# EAGLE design carlos_lm3886 (EAGLE 7.6.0)
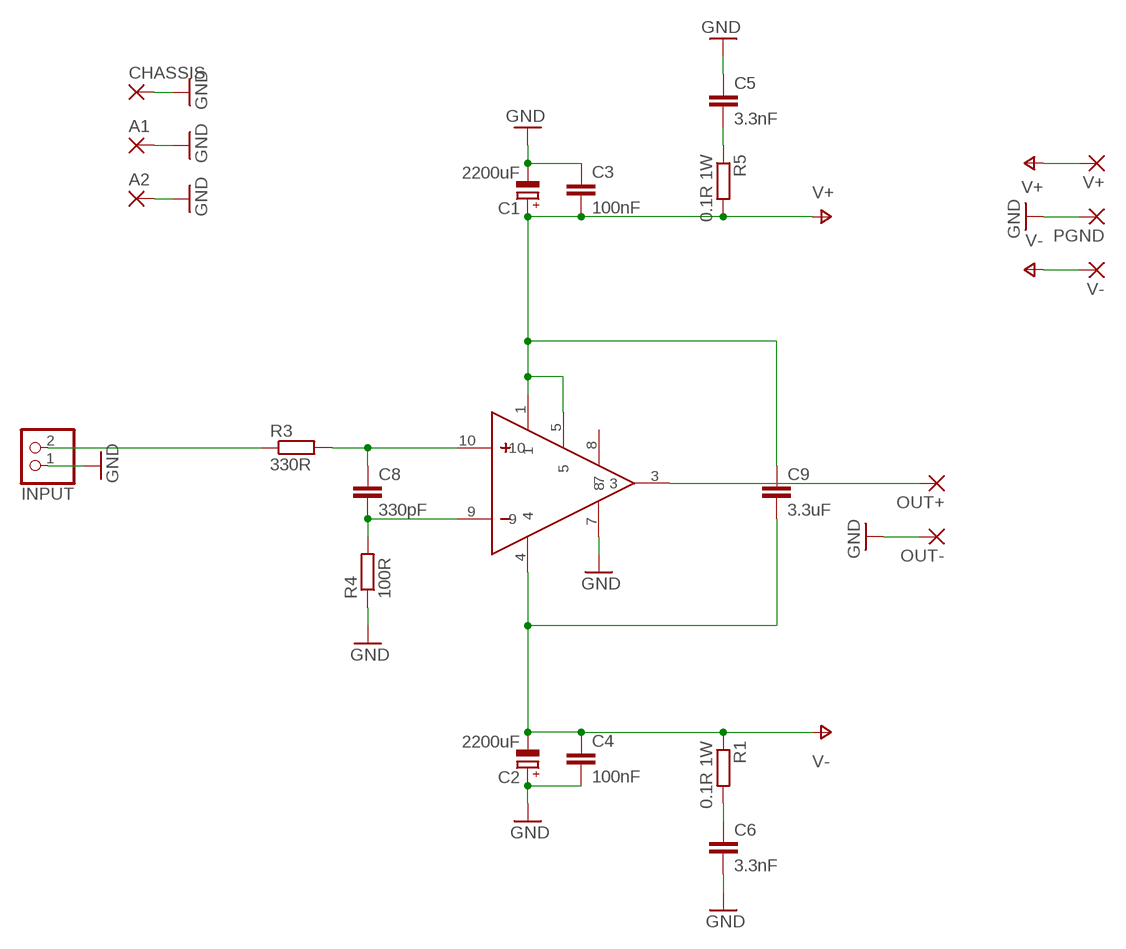
[diagram p0: schematic, sheet 1]

## Parts
A1  2,54/1,0  [2,54/1,0]
A2  2,54/1,0  [2,54/1,0]
C1  2200uF  CPOL-EUE7.5-18  [E7,5-18]
C2  2200uF  CPOL-EUE7.5-18  [E7,5-18]
C3  100nF  C-EU150-054X183  [C150-054X183]
C4  100nF  C-EU150-054X183  [C150-054X183]
C5  3.3nF  C-EU075-032X103  [C075-032X103]
C6  3.3nF  C-EU075-032X103  [C075-032X103]
C8  330pF  C-EU050-045X075  [C050-045X075]
C9  3.3uF  C-EU225-087X268  [C225-087X268]
CHASSIS  2,54/1,0  [2,54/1,0]
INPUT  PINHD-1X2  [1X02]
OUT+  2,54/1,0  [2,54/1,0]
OUT-  2,54/1,0  [2,54/1,0]
PGND  2,54/1,0  [2,54/1,0]
R1  0.1R 1W  R-EU_0309/10  [0309/10]
R3  330R  R-EU_0207/10  [0207/10]
R4  100R  R-EU_0207/10  [0207/10]
R5  0.1R 1W  R-EU_0309/10  [0309/10]
U$1  LM3886T  [TO220-11]
V+  2,54/1,0  [2,54/1,0]
V-  2,54/1,0  [2,54/1,0]

## Nets
GND: A1.1(P) A2.1(P) C1.- C2.+ C3.1 C4.2 C5.1 C6.2 CHASSIS.1(P) INPUT.1 OUT-.1(P) PGND.1(P) R4.1 U$1.7
N$1: INPUT.2 R3.1
N$3: C6.1 R1.2
N$4: C5.2 R5.1
N$5: C8.1 R3.2 U$1.10
N$6: C8.2 R4.2 U$1.9
N$7: OUT+.1(P) U$1.3
V+: C1.+ C3.2 C9.1 R5.2 U$1.1 U$1.5 V+.1(P)
V-: C2.- C4.1 C9.2 R1.1 U$1.4 V-.1(P)
Unconnected: U$1.8

## Library data of the parts
A1 A2 CHASSIS OUT+ OUT- PGND V+ V- = wirepad:2,54/1,0: THROUGH-HOLE PAD
C1 C2 = rcl:CPOL-EU: POLARIZED CAPACITOR, European symbol
C3-C6 C8 C9 = rcl:C-EU: CAPACITOR, European symbol
INPUT = pinhead:PINHD-1X2: PIN HEADER
R1 R5 = resistor:R-EU_: RESISTOR, European symbol
R3 R4 = rcl:R-EU_: RESISTOR, European symbol
U$1 = LM3886:LM3886

## Board
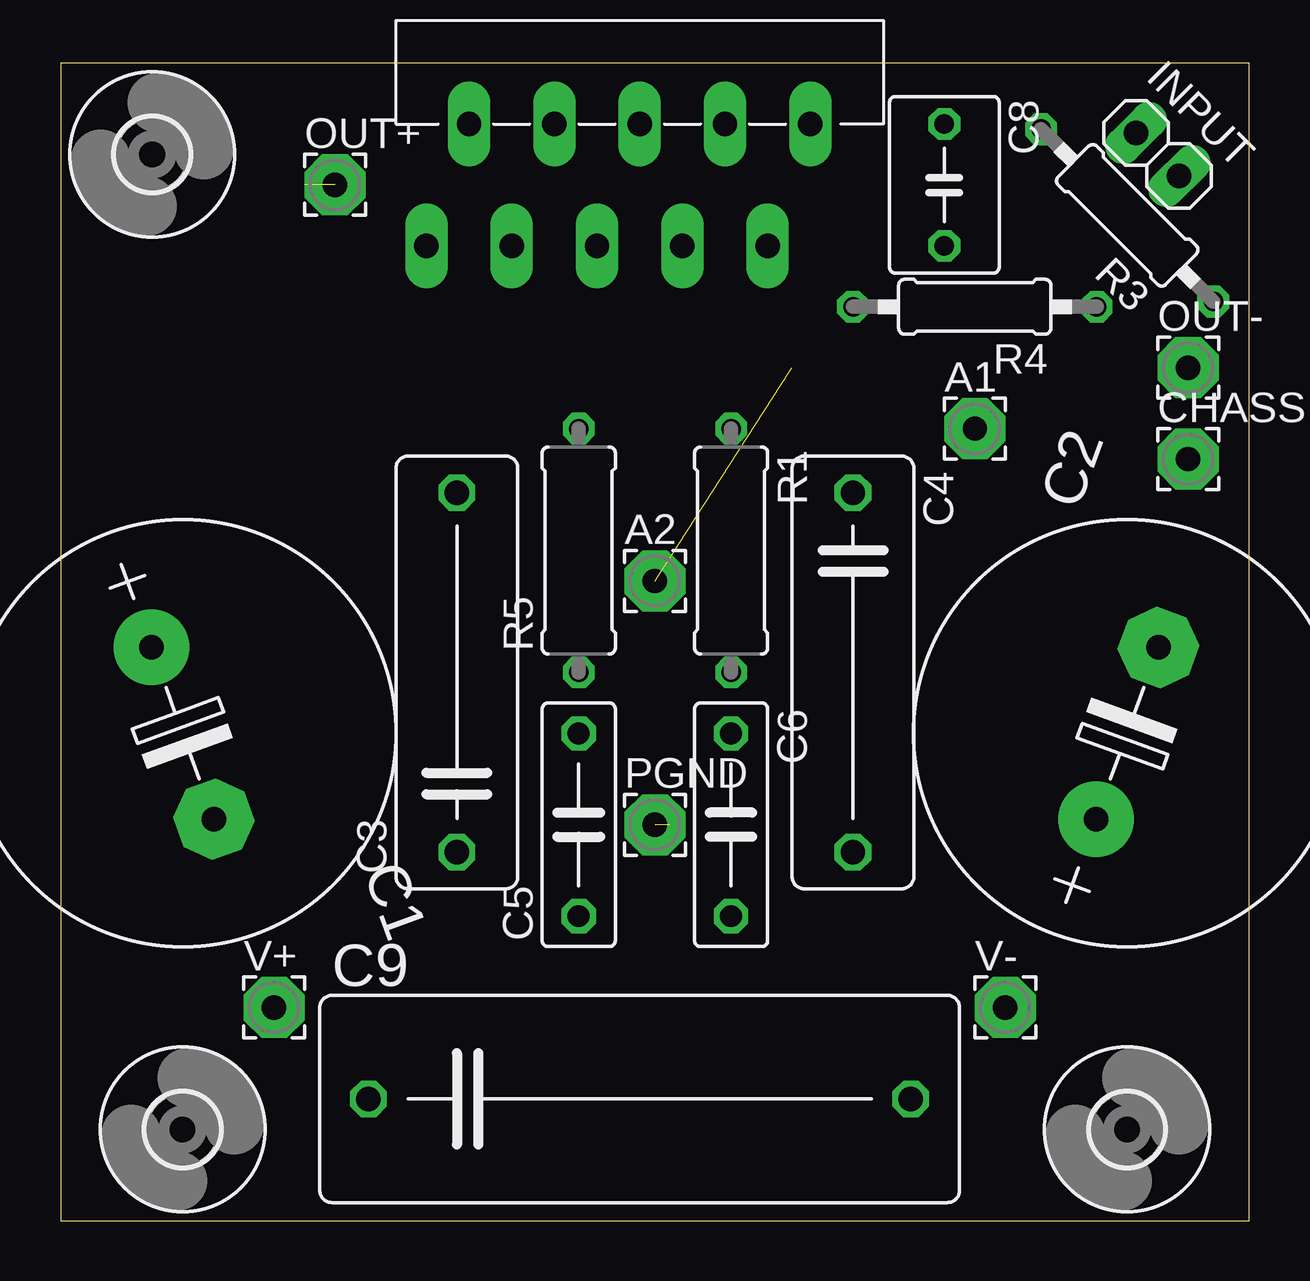
[diagram p1: board, top side]
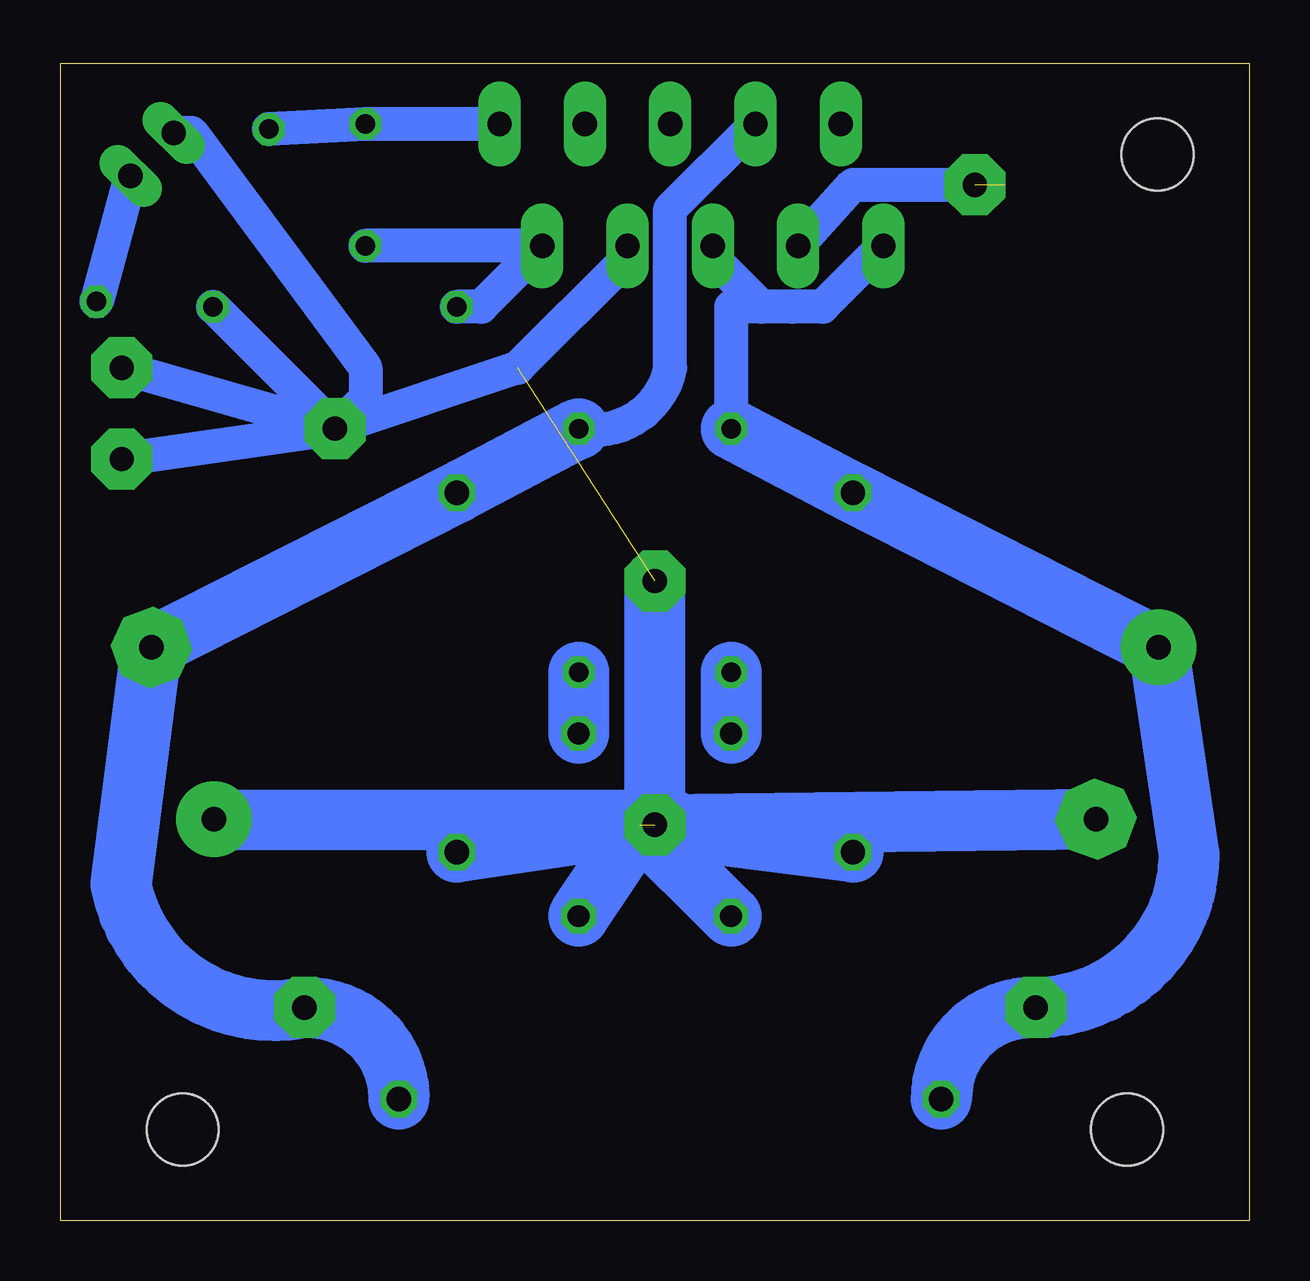
[diagram p2: board, bottom side, seen from below]

Size 49.53 x 48.26 mm. Coordinates in mm from the lower left corner, seen from the top.
Outline: 0,0 49.53,0 49.53,48.26 0,48.26 0,0
Copper layers (1*16): Top 0.035mm / dielectric 1.5mm / Bottom 0.035mm
Design rules "default": minimum track width 10mil, minimum drill 24mil, track to track 8mil, track to pad 8mil, pad to pad 8mil, via to via 8mil, smd to smd 8mil, copper to edge 40mil, drill to drill 8mil, minimum pad ring 10mil, minimum via ring 8mil, stop-mask expansion 4mil, vias tented up to drill 0mil, thermal gap 10mil

### Footprints (pad centres in the part's own frame; a part is rotated, then mirrored left to right if it is on the bottom)
2,54/1,0 = drill 1.016 pad 2.54 octagon: 1 0,0
E7,5-18 = drill 1.016 pad 3.15: + -3.81,0 | drill 1.016 pad 3.15 octagon: - 3.81,0
C150-054X183 = drill 1.016 octagon: 1 -7.493,0; 2 7.493,0
C075-032X103 = drill 0.914 octagon: 1 -3.81,0; 2 3.81,0
C050-045X075 = drill 0.813 octagon: 1 -2.54,0; 2 2.54,0
C225-087X268 = drill 1.016 octagon: 1 -11.303,0; 2 11.303,0
1X02 = drill 1.016 long: 1 -1.27,0; 2 1.27,0
0309/10 = drill 0.813 octagon: 1 -5.08,0; 2 5.08,0
0207/10 = drill 0.813 octagon: 1 -5.08,0; 2 5.08,0
TO220-11 = drill 1.016 pad 1.778 long: 1 -8.89,-2.54; 2 -7.112,2.54; 3 -5.334,-2.54; 4 -3.556,2.54; 5 -1.778,-2.54; 6 0,2.54; 7 1.778,-2.54; 8 3.556,2.54; 9 5.334,-2.54; 10 7.112,2.54
3,0 = hole 3: 0,0

### Placement (x,y rotation side)
A1  38.1,33.02 0 top
A2  24.77,26.67 0 top
C1  5.08,20.32 290 top
C2  44.45,20.32 70 top
C3  16.51,22.86 90 top
C4  33.02,22.86 270 top
C5  21.59,16.51 90 top
C6  27.94,16.51 270 top
C8  36.83,43.18 270 top
C9  24.13,5.08 0 top
CHASSIS  46.99,31.75 0 top
INPUT  45.72,44.45 315 top
OUT+  11.43,43.18 0 top
OUT-  46.99,35.56 0 top
PGND  24.77,16.51 0 top
R1  27.94,27.94 270 top
R3  44.45,41.91 135 top
R4  38.1,38.1 180 top
R5  21.59,27.94 90 top
U$1  24.13,43.18 0 top
U$2  [3,0]  5.08,3.81 0 top
U$3  [3,0]  44.45,3.81 0 top
U$4  [3,0]  3.81,44.45 0 top
V+  8.89,8.89 0 top
V-  39.37,8.89 0 top

### Tracks (layer width: path | path; a pad name or v marks a point on that pad's centre or on a via)
GND  (2 unrouted)
  Bottom 1.422: 24.06,16.71 PGND.1 | 24.06,16.71 24.13,16.51 23.5,15.88 | 24.06,16.71 24.77,17.27 | U$1.7 25.91,40.13 30.48,35.56 A1.1 | INPUT.1 44.08,45.35 36.83,35.56 36.83,34.29 A1.1 | R4.1 A1.1 | OUT-.1 A1.1 | CHASSIS.1 A1.1
  Bottom 2.54: C1.- PGND.1 | C2.+ 24.06,16.71 | 24.77,17.27 A2.1 | C5.1 25.4,16.51 | 25.4,16.51 C6.2 | C3.1 25.4,16.51 | C4.2 25.4,16.51
N$1
  Bottom 1.422: INPUT.2 R3.1
N$3
  Bottom 2.54: R1.2 C6.1
N$4
  Bottom 2.54: R5.1 C5.2
N$5
  Bottom 1.422: U$1.10 C8.1 R3.2
N$6
  Bottom 1.422: C8.2 U$1.9 32,38.1 R4.2
N$7  (1 unrouted)
  Bottom 1.422: U$1.3 16.51,43.18 OUT+.1
V+
  Bottom 1.422: U$1.1 17.78,38.1 19.05,38.1 20.32,38.1 | 20.32,38.1 22.35,40.13 U$1.5 | V+.1 9.02,8.89 | 20.32,38.1 21.59,38.1 R5.2
  Bottom 2.54: R5.2 C3.2 C1.+ 2.51,15.27 arc90 V+.1 | 9.02,8.89 arc-90 C9.1
V-
  Bottom 1.422: U$1.4 24.13,42.16 24.13,35.56 arc90 R1.1 | V-.1 39.24,8.89
  Bottom 2.54: R1.1 C4.1 C2.- 47.02,14 arc-90 V-.1 | 39.24,8.89 arc90 C9.2